# EAGLE design PCB (EAGLE 9.6.2)
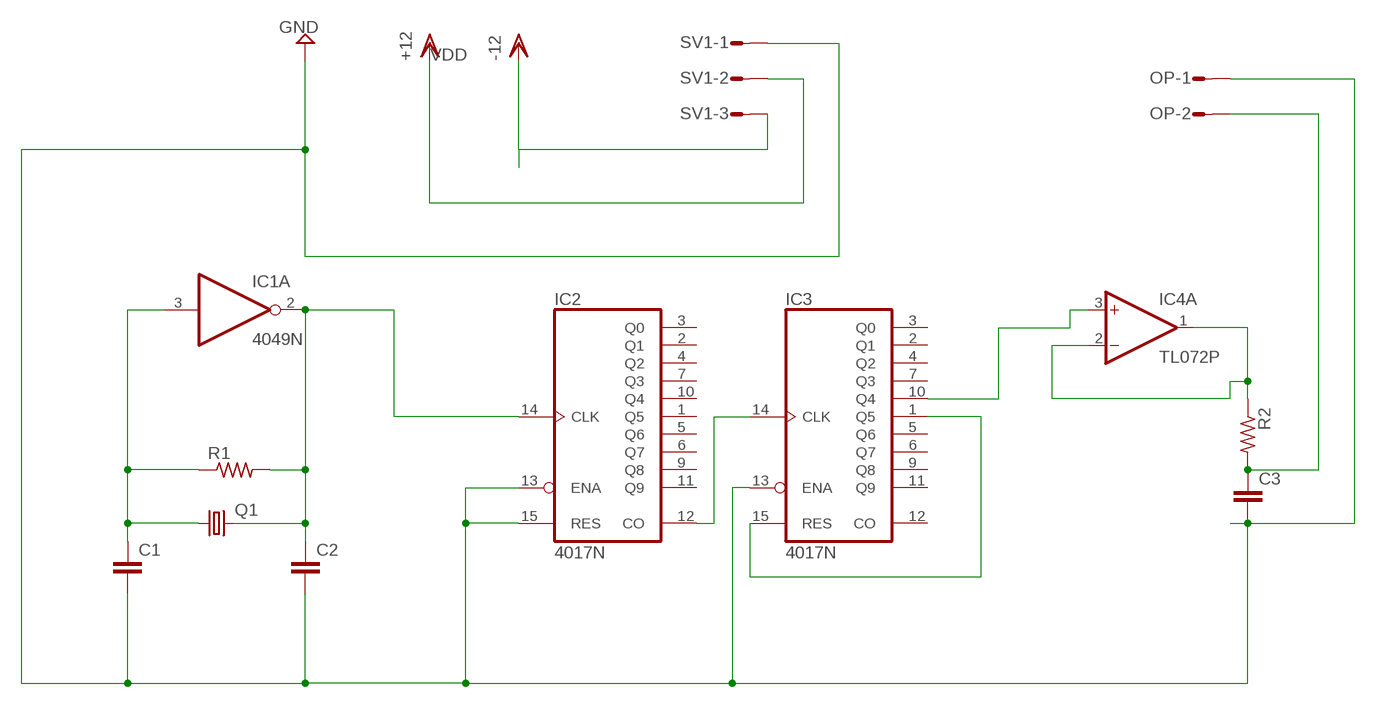
[diagram p0: schematic, sheet 1]

## Parts
C1  C5/3.5  [C5B3.5]
C2  C5/3.5  [C5B3.5]
C3  C5/3.5  [C5B3.5]
IC1  4049N  [DIL16]
IC2  4017N  [DIL16]
IC3  4017N  [DIL16]
IC4  TL072P  [DIL08]
OP  L02P  [L02P]
Q1  CRYSTALHC33U-V  [HC33U-V]
R1  R-US_0207/12  [0207/12]
R2  R-US_0207/12  [0207/12]
SV1  L03P  [L03P]

## Nets
GND: C1.2 C2.2 C3.2 IC2.13(ENA) IC2.15(RES) IC3.13(ENA) OP.1 SV1.1
N$1: C1.1 IC1.3(A:I) Q1.1 R1.1
N$2: C2.1 IC1.2(A:O) IC2.14(CLK) Q1.2 R1.2
N$3: C3.1 OP.2 R2.2
N$4: IC3.1(Q5) IC3.15(RES)
N$5: IC3.10(Q4) IC4.3(A:+IN)
N$6: IC4.1(A:OUT) IC4.2(A:-IN) R2.1
N$8: IC2.12(CO) IC3.14(CLK)
VDD: SV1.2 SV1.3 ; supply symbol labelled -12, +12
Unconnected: IC1.4(B:O) IC1.5(B:I) IC1.6(C:O) IC1.7(C:I) IC1.9(D:I) IC1.10(D:O) IC1.11(E:I) IC1.12(E:O) IC1.14(F:I) IC1.15(F:O) IC2.1(Q5) IC2.2(Q1) IC2.3(Q0) IC2.4(Q2) IC2.5(Q6) IC2.6(Q7) IC2.7(Q3) IC2.9(Q8) IC2.10(Q4) IC2.11(Q9) IC3.2(Q1) IC3.3(Q0) IC3.4(Q2) IC3.5(Q6) IC3.6(Q7) IC3.7(Q3) IC3.9(Q8) IC3.11(Q9) IC3.12(CO) IC4.5(B:+IN) IC4.6(B:-IN) IC4.7(B:OUT)

## Power pins joined to a net without a drawn wire
V+: IC4.8(P:V+)
V-: IC4.4(P:V-)
VDD: IC1.1(P:VDD) IC2.16(VDD) IC3.16(VDD)
VSS: IC1.8(P:VSS) IC2.8(VSS) IC3.8(VSS)

## Library data of the parts
C1-C3 = capacitor-wima:C: CAPACITOR naming: grid - package width
IC1 = 40xx:4049: Hex inverting BUFFER
IC2 IC3 = 40xx:4017: COUNTER/DIVIDER
IC4 = linear:TL072: OP AMP
OP = con-amp-mt:L02P: AMP MT CONNECTOR; OC_FARNELL: unknown; OC_NEWARK: unknown
Q1 = crystal:CRYSTAL: CRYSTAL; OC_FARNELL: unknown; OC_NEWARK: unknown
R1 R2 = rcl:R-US_: RESISTOR, American symbol; SPICEPREFIX: R
SV1 = con-amp-mt:L03P: AMP MT CONNECTOR; OC_FARNELL: unknown; OC_NEWARK: unknown

## Board
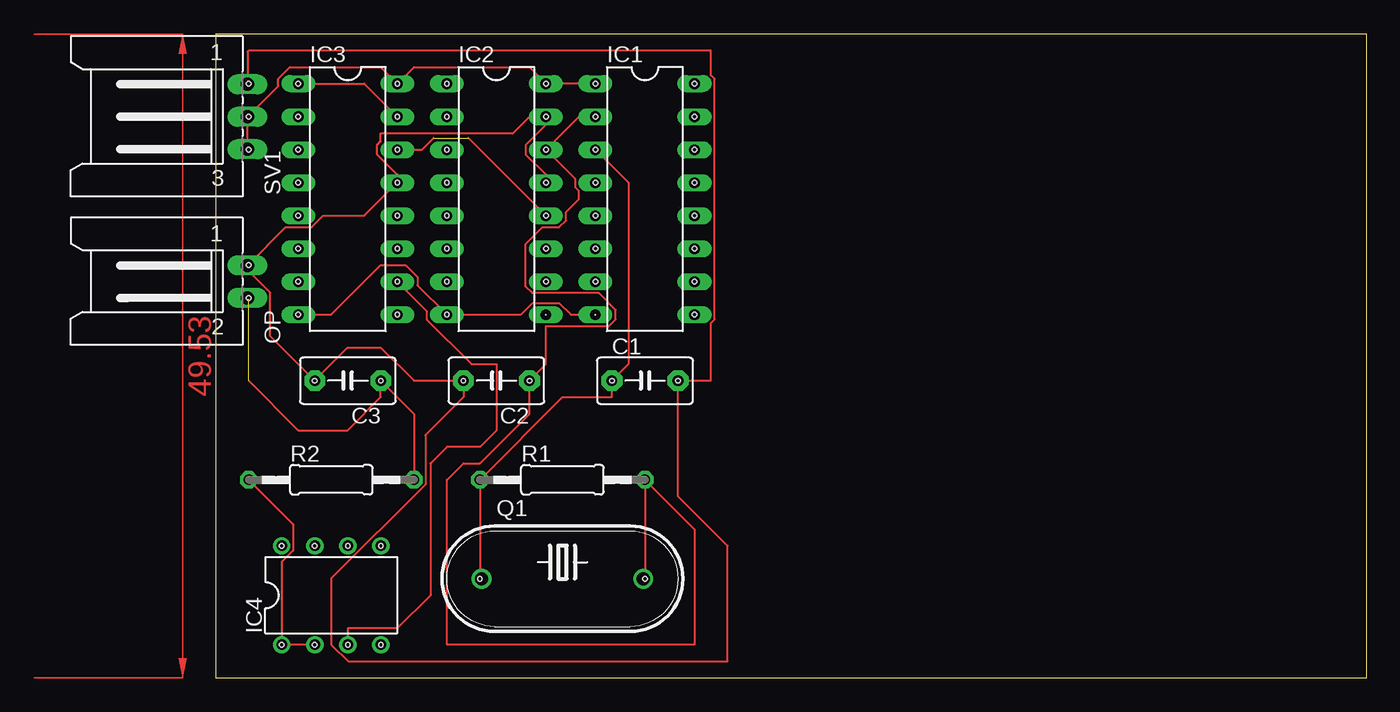
[diagram p1: board, top side]

Size 88.57 x 49.52 mm. Coordinates in mm from the lower left corner, seen from the top.
Outline: 0,0 88.57,0 88.57,49.52 0,49.52 0,0
Copper layers (1*16): Top 0.035mm / dielectric 1.5mm / Bottom 0.035mm
Design rules "default": minimum track width 6mil, minimum drill 0.35mm, track to track 6mil, track to pad 6mil, pad to pad 6mil, via to via 6mil, smd to smd 6mil, copper to edge 40mil, drill to drill 6mil, minimum pad ring 10mil, minimum via ring 8mil, stop-mask expansion 4mil, vias tented up to drill 0mil, thermal gap 10mil
Holes 0.35 mm at 2.54,45.72 2.54,43.18 2.54,40.64 6.35,45.72 6.35,43.18 6.35,40.64 6.35,38.1 6.35,35.56 6.35,33.02 6.35,30.48 6.35,27.94 2.54,29.21 2.54,31.75 13.97,27.94 13.97,30.48 13.97,33.02 13.97,35.56 13.97,38.1 13.97,40.64 13.97,43.18 13.97,45.72 17.78,45.72 17.78,43.18 17.78,40.64 17.78,38.1 17.78,35.56 17.78,33.02 17.78,30.48 17.78,27.94 7.62,22.86 12.7,22.86 19.05,22.86 24.13,22.86 25.4,30.48 25.4,33.02 25.4,35.56 25.4,38.1 25.4,40.64 25.4,43.18 25.4,45.72 29.21,45.72 29.21,43.18 29.21,40.64 29.21,38.1 29.21,35.56 29.21,33.02 29.21,30.48 36.83,27.94 36.83,30.48 36.83,33.02 36.83,35.56 36.83,38.1 36.83,40.64 36.83,43.18 36.83,45.72 20.32,7.62 33.02,7.62 33.02,15.24 20.32,15.24 12.7,2.54 10.16,2.54 7.62,2.54 5.08,2.54 5.08,10.16 7.62,10.16 10.16,10.16 12.7,10.16 15.24,15.24 2.54,15.24 30.48,22.86 35.56,22.86
Holes 0.02 mm at 25.4,27.94 29.21,27.94

### Footprints (pad centres in the part's own frame; a part is rotated, then mirrored left to right if it is on the bottom)
C5B3.5 = drill 0.813 pad 1.6 octagon: 1 -2.54,0; 2 2.54,0
DIL16 = drill 0.813 long: 1 -8.89,-3.81; 2 -6.35,-3.81; 3 -3.81,-3.81; 4 -1.27,-3.81; 5 1.27,-3.81; 6 3.81,-3.81; 7 6.35,-3.81; 8 8.89,-3.81; 9 8.89,3.81; 10 6.35,3.81; 11 3.81,3.81; 12 1.27,3.81; 13 -1.27,3.81; 14 -3.81,3.81; 15 -6.35,3.81; 16 -8.89,3.81
DIL08 = drill 0.813 pad 1.27: 1 -3.81,-3.81; 2 -1.27,-3.81; 3 1.27,-3.81; 4 3.81,-3.81; 5 3.81,3.81; 6 1.27,3.81; 7 -1.27,3.81; 8 -3.81,3.81
L02P = drill 1.016 long: 1 1.25,-6.25; 2 -1.25,-6.25
HC33U-V = drill 1.016: 1 -6.223,0; 2 6.223,0
0207/12 = drill 0.813 octagon: 1 -6.35,0; 2 6.35,0
L03P = drill 1.016 long: 1 2.5,-6.25; 2 0,-6.25; 3 -2.5,-6.25

### Placement (x,y rotation side)
C1  33.02,22.86 0 top
C2  21.59,22.86 180 top
C3  10.16,22.86 180 top
IC1  33.02,36.83 270 top
IC2  21.59,36.83 270 top
IC3  10.16,36.83 270 top
IC4  8.89,6.35 0 top
OP  -3.81,30.48 90 top
Q1  26.67,7.62 0 top
R1  26.67,15.24 0 top
R2  8.89,15.24 0 top
SV1  -3.81,43.18 90 top

### Tracks (layer width: path | path; a pad name or v marks a point on that pad's centre or on a via)
GND
  Top 0.152: IC2.13 25.4,38.72 23.85,40.27 23.85,41.01 25.4,42.56 IC2.15 24.13,43.18 22.86,41.91 12.7,41.91 12.7,41.29 12.42,41.01 12.42,40.27 13.97,38.72 IC3.13 11.43,35.56 8.27,35.56 7.38,34.67 5.38,34.67 OP.1 2.46,31.75 2.54,31.75 2.54,31.29 4.19,29.64 4.19,26.29 C3.2 10.16,25.4 12.7,25.4 15.24,22.86 C2.2 19.05,21.59 16.13,18.67 16.13,14.87 8.89,7.63 8.89,2.55 10.17,1.27 39.37,1.27 39.37,10.16 35.56,13.97 C1.2 38.1,22.86 38.1,27.29 38.38,27.57 38.38,46.09 38.1,46.37 38.1,48.26 2.54,48.26 2.44,48.16 SV1.1
N$1
  Top 0.152: IC1.3 31.75,38.1 31.75,24.13 C1.1 30.48,21.59 26.67,21.59 R1.1 20.32,7.75 Q1.1
N$2
  Top 0.152: IC1.2 27.94,43.18 IC2.14 27.66,38.38 27.66,37.73 27.94,37.45 27.94,36.83 26.95,35.84 26.95,35.19 26.43,34.67 25.13,34.67 23.85,33.39 23.85,30.11 24.37,29.59 29.48,29.59 30.76,28.31 30.76,27.57 30.24,27.05 25.4,27.05 25.4,24.13 C2.1 24.13,20.32 20.32,16.51 19.05,16.51 17.78,15.24 17.78,2.54 36.83,2.54 36.83,11.43 R1.2 33.02,7.75 Q1.2
N$3  (1 unrouted)
  Top 0.152: R2.2 15.24,20.32 C3.1 12.7,21.59 10.16,19.05 6.35,19.05 2.54,22.86 | OP.2 2.54,29.13
N$4
  Top 0.152: IC3.1 11.43,45.72 IC3.15
N$5
  Top 0.152: IC3.10 16.23,28.22 16.23,27.57 19.67,24.13 21.59,24.13 21.59,19.05 20.32,17.78 17.78,17.78 16.51,16.51 16.51,6.35 13.97,3.81 10.16,3.81 IC4.3
N$6
  Top 0.152: R2.1 5.97,11.81 5.97,9.79 5.08,8.9 IC4.1 IC4.2
N$8  (1 unrouted)
  Top 0.152: IC3.14 15.86,40.64 16.75,41.53 | 19.43,41.53 IC2.12
VDD
  Top 0.152: IC1.1 IC2.16 24.13,46.99 15.24,46.99 IC3.16 12.7,46.99 5.7,46.99 4.8,46.09 4.8,45.54 SV1.2 SV1.3
VSS
  Top 0.152: IC3.8 8.89,27.94 12.7,31.75 14.62,31.75 15.52,30.85 15.52,30.2 IC2.8 23.48,27.94 24.37,28.83 26.43,28.83 27.32,27.94 IC1.8
(copper drawn outside any net)
  shapes: Top area x2